# EAGLE design pomodoro (EAGLE 9.6.1)
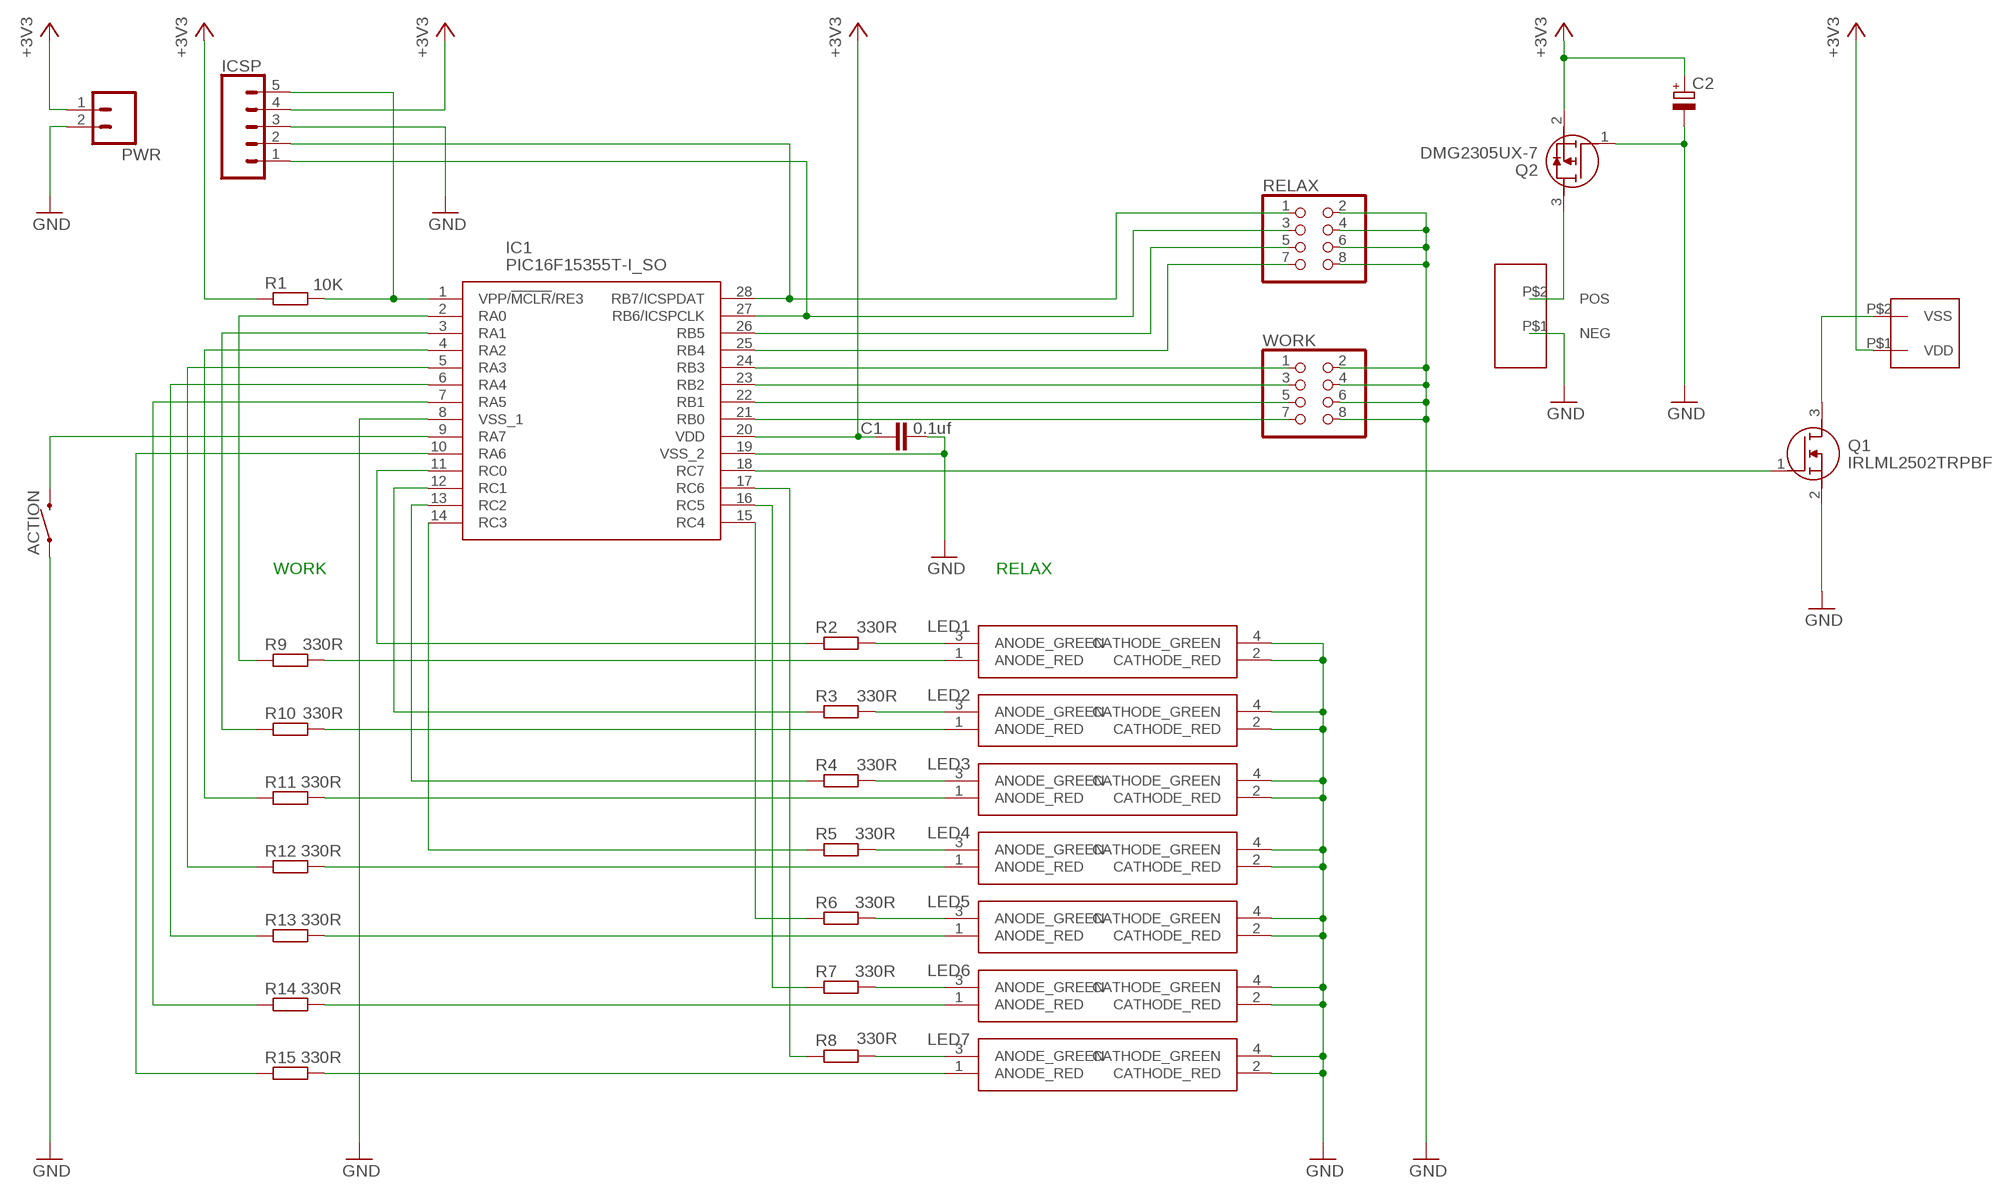
[diagram p0: schematic, sheet 1]

## Parts
ACTION  MOMENTARY-SWITCH-SPST-SMD-6.0X3.5MM  [TACTILE_SWITCH_SMD_6.0X3.5MM]
C1  0.1uf  C-EUC0805  [C0805]
C2  CPOL-EUE2.5-5  [E2,5-5]
IC1  PIC16F15355T-I_SO  [SOIC127P1030X265-28M]
ICSP  CONN_05  [1X05]
LED1  APBD3224LSURKCGKC  [APBD3224LSURKCGKC]
LED2  APBD3224LSURKCGKC  [APBD3224LSURKCGKC]
LED3  APBD3224LSURKCGKC  [APBD3224LSURKCGKC]
LED4  APBD3224LSURKCGKC  [APBD3224LSURKCGKC]
LED5  APBD3224LSURKCGKC  [APBD3224LSURKCGKC]
LED6  APBD3224LSURKCGKC  [APBD3224LSURKCGKC]
LED7  APBD3224LSURKCGKC  [APBD3224LSURKCGKC]
PWR  CONN_02  [1X02]
Q1  IRLML2502TRPBF  [SOT95P237X112-3N]
Q2  DMG2305UX-7  [SOT96P240X115-3N]
R1  10K  R-EU_R0805  [R0805]
R2  330R  R-EU_R0805  [R0805]
R3  330R  R-EU_R0805  [R0805]
R4  330R  R-EU_R0805  [R0805]
R5  330R  R-EU_R0805  [R0805]
R6  330R  R-EU_R0805  [R0805]
R7  330R  R-EU_R0805  [R0805]
R8  330R  R-EU_R0805  [R0805]
R9  330R  R-EU_R0805  [R0805]
R10  330R  R-EU_R0805  [R0805]
R11  330R  R-EU_R0805  [R0805]
R12  330R  R-EU_R0805  [R0805]
R13  330R  R-EU_R0805  [R0805]
R14  330R  R-EU_R0805  [R0805]
R15  330R  R-EU_R0805  [R0805]
RELAX  PINHD-2X4  [2X04]
U$1  2AAABATT  [2AAABATTSER]
U$2  BUZZER8X8  [BUZZER8X8]
WORK  PINHD-2X4  [2X04]

## Nets
+3V3: C1.1 C2.+ IC1.20(VDD) ICSP.4 PWR.1 Q2.2(S) R1.1 U$2.P$1(VDD)
GND: ACTION.1 C1.2 C2.- IC1.8(VSS_1) IC1.19(VSS_2) ICSP.3 LED1.2(CATHODE_RED) LED1.4(CATHODE_GREEN) LED2.2(CATHODE_RED) LED2.4(CATHODE_GREEN) LED3.2(CATHODE_RED) LED3.4(CATHODE_GREEN) LED4.2(CATHODE_RED) LED4.4(CATHODE_GREEN) LED5.2(CATHODE_RED) LED5.4(CATHODE_GREEN) LED6.2(CATHODE_RED) LED6.4(CATHODE_GREEN) LED7.2(CATHODE_RED) LED7.4(CATHODE_GREEN) PWR.2 Q1.2(S) Q2.1(G) RELAX.2 RELAX.4 RELAX.6 RELAX.8 U$1.P$1(NEG) WORK.2 WORK.4 WORK.6 WORK.8
N$1: IC1.1(VPP/!MCLR!/RE3) ICSP.5 R1.2
N$2: LED1.1(ANODE_RED) R9.2
N$3: LED2.1(ANODE_RED) R10.2
N$4: IC1.28(RB7/ICSPDAT) ICSP.2 RELAX.1
N$5: IC1.27(RB6/ICSPCLK) ICSP.1 RELAX.3
N$6: LED3.1(ANODE_RED) R11.2
N$7: LED4.1(ANODE_RED) R12.2
N$8: LED5.1(ANODE_RED) R13.2
N$9: LED6.1(ANODE_RED) R14.2
N$10: LED7.1(ANODE_RED) R15.2
N$11: LED1.3(ANODE_GREEN) R2.2
N$12: LED2.3(ANODE_GREEN) R3.2
N$13: LED3.3(ANODE_GREEN) R4.2
N$14: LED4.3(ANODE_GREEN) R5.2
N$15: LED5.3(ANODE_GREEN) R6.2
N$16: LED6.3(ANODE_GREEN) R7.2
N$17: LED7.3(ANODE_GREEN) R8.2
N$18: ACTION.2 IC1.9(RA7)
N$19: IC1.11(RC0) R2.1
N$20: IC1.12(RC1) R3.1
N$21: IC1.13(RC2) R4.1
N$22: IC1.14(RC3) R5.1
N$23: IC1.15(RC4) R6.1
N$24: IC1.16(RC5) R7.1
N$25: IC1.17(RC6) R8.1
N$26: IC1.18(RC7) Q1.1(G)
N$27: IC1.21(RB0) WORK.7
N$28: IC1.22(RB1) WORK.5
N$29: IC1.23(RB2) WORK.3
N$30: IC1.24(RB3) WORK.1
N$31: IC1.25(RB4) RELAX.7
N$32: IC1.26(RB5) RELAX.5
N$33: IC1.2(RA0) R9.1
N$34: IC1.3(RA1) R10.1
N$35: IC1.4(RA2) R11.1
N$36: IC1.5(RA3) R12.1
N$37: IC1.6(RA4) R13.1
N$38: IC1.7(RA5) R14.1
N$39: IC1.10(RA6) R15.1
N$40: Q1.3(D) U$2.P$2(VSS)
N$41: Q2.3(D) U$1.P$2(POS)

## Notes on the sheet
- WORK | RELAX

## Library data of the parts
ACTION = SparkFun-Switches:MOMENTARY-SWITCH-SPST: Momentary Switch (Pushbutton) - SPST Normally-open (NO) SPST momentary switches (buttons, pushbuttons). Variants PTH-12MM - 12mm square, through-hole Momentary Pushbutton Switch - 12mm Square <https://www.sparkfun.com/products/9190> (COM-09190) PTH-6.0MM, PTH-6.0MM-KIT - 6.0mm square, through-hole Mini Pushbutton Switch <https://www.sparkfun.com/products/97> (COM-00097) KIT package intended for soldering kit's - only one side of pads' copper is exposed. PTH-RIGHT-ANGLE-KIT - Right-angle, through-hole Right Angle Tactile Button <https://www.sparkfun.com/products/10791> - Used on SparkFun BigTime Watch Kit <https://www.sparkfun.com/products/11734> SMD-12MM - 12mm square, surface-mount Tactile Button - SMD (12mm) <https://www.sparkfun.com/products/12993> (COM-12993) Used on SparkFun PicoBoard <https://www.sparkfun.com/products/11888> SMD-4.5MM - 4.5mm Square Trackball Switch Used on SparkFun Blackberry Trackballer Breakout <https://www.sparkfun.com/products/13169> SMD-4.6MMX2.8MM - 4.60mm x 2.80mm, surface mount Used on SparkFun SAMD21 Mini Breakout <https://www.sparkfun.com/products/13664> SMD-5.2MM, SMD-5.2-REDUNDANT - 5.2mm square, surface-mount Mini Pushbutton Switch - SMD <https://www.sparkfun.com/products/8720> (COM-08720) Used on Arduino Pro Mini <https://www.sparkfun.com/products/11114> REDUNDANT package connects both switch circuits together SMD-6.0X3.5MM - 6.0 x 3.5mm, surface mount Momentary Reset Switch SMD <https://www.sparkfun.com/products/8229> (COM-08229) SMD-6.2MM-TALL - 6.2mm square, surface mount Tactile Button - SMD (6mm) <https://www.sparkfun.com/products/12992> Used on SparkFun Digital Sandbox <https://www.sparkfun.com/products/12651> SMD-RIGHT-ANGLE - Right-angle, surface mount Used on SparkFun Block for Intel® Edison - Arduino <https://www.sparkfun.com/products/13036>; PROD_ID: SWCH-14278; SF_SKU: COM-08229
C1 = rcl:C-EU: CAPACITOR, European symbol; SPICEPREFIX: C
C2 = rcl:CPOL-EU: POLARIZED CAPACITOR, European symbol; SPICEPREFIX: C
IC1 = PIC16F15355T-I_SO:PIC16F15355T-I_SO: MCU 8-bit PIC RISC 14KB Flash 3.3V/5V 28-Pin SOIC W T/R Source: Datasheet <https://componentsearchengine.com/Datasheets/1/PIC16F15355T-I_SO.pdf>; DESCRIPTION: MCU 8-bit PIC RISC 14KB Flash 3.3V/5V 28-Pin SOIC W T/R; HEIGHT: 2.65mm; MANUFACTURER_NAME: Microchip; MANUFACTURER_PART_NUMBER: PIC16F15355T-I/SO; MOUSER_PART_NUMBER: 579-PIC16F15355TI/SO; MOUSER_PRICE-STOCK: https://www.mouser.co.uk/ProductDetail/Microchip-Technology/PIC16F15355T-I-SO?qs=8cKuZ6Ok2lZJ%2F9aGIYkbmQ%3D%3D
ICSP = SparkFun-Connectors:CONN_05: Multi connection point. Often used as Generic Header-pin footprint for 0.1 inch spaced/style header connections On any of the 0.1 inch spaced packages, you can populate with these: Break Away Headers - Straight <https://www.sparkfun.com/products/116> (PRT-00116) Break Away Male Headers - Right Angle <https://www.sparkfun.com/products/553> (PRT-00553) Female Headers <https://www.sparkfun.com/products/115> (PRT-00115) Break Away Headers - Machine Pin <https://www.sparkfun.com/products/117> (PRT-00117) Break Away Female Headers - Swiss Machine Pin <https://www.sparkfun.com/products/743> (PRT-00743) For SCREWTERMINALS and SPRING TERMINALS visit here: Screw Terimnals on SparkFun.com <https://www.sparkfun.com/search/results?term=Screw+Terminals> (5mm/3.5mm/2.54mm spacing) This device is also useful as a general connection point to wire up your design to another part of your project. Our various solder wires solder well into these plated through hole pads. Hook-Up Wire - Assortment (Stranded, 22 AWG) <https://www.sparkfun.com/products/11375> (PRT-11375) Hook-Up Wire - Assortment (Solid Core, 22 AWG) <https://www.sparkfun.com/products/11367> (PRT-11367) View the entire wire category on our website here <https://www.sparkfun.com/categories/141> Special notes: Molex polarized connector foot print use with SKU : PRT-08231 with associated crimp pins and housings. 1MM SMD Version SKU: PRT-10208
LED1-LED7 = APBD3224LSURKCGKC:APBD3224LSURKCGKC: Standard LEDs - SMD 3.2x2.4MM LOW CU RED/GREEN SMD Source: Datasheet <https://www.kingbrightusa.com/images/catalog/SPEC/APBD3224LSURKCGKC.pdf>; DESCRIPTION: Standard LEDs - SMD 3.2x2.4MM LOW CU RED/GREEN SMD; HEIGHT: 2.4mm; MANUFACTURER_NAME: Kingbright; MANUFACTURER_PART_NUMBER: APBD3224LSURKCGKC; MOUSER_PART_NUMBER: 604-APBD3224LSURKCGK; MOUSER_PRICE-STOCK: https://www.mouser.co.uk/ProductDetail/Kingbright/APBD3224LSURKCGKC?qs=ZqXcJfGlKsjckDFm0SXANw%3D%3D
PWR = SparkFun-Connectors:CONN_02: Multi connection point. Often used as Generic Header-pin footprint for 0.1 inch spaced/style header connections On any of the 0.1 inch spaced packages, you can populate with these: Break Away Headers - Straight <https://www.sparkfun.com/products/116> (PRT-00116) Break Away Male Headers - Right Angle <https://www.sparkfun.com/products/553> (PRT-00553) Female Headers <https://www.sparkfun.com/products/115> (PRT-00115) Break Away Headers - Machine Pin <https://www.sparkfun.com/products/117> (PRT-00117) Break Away Female Headers - Swiss Machine Pin <https://www.sparkfun.com/products/743> (PRT-00743) For SCREWTERMINALS and SPRING TERMINALS visit here: Screw Terimnals on SparkFun.com <https://www.sparkfun.com/search/results?term=Screw+Terminals> (5mm/3.5mm/2.54mm spacing) This device is also useful as a general connection point to wire up your design to another part of your project. Our various solder wires solder well into these plated through hole pads. Hook-Up Wire - Assortment (Stranded, 22 AWG) <https://www.sparkfun.com/products/11375> (PRT-11375) Hook-Up Wire - Assortment (Solid Core, 22 AWG) <https://www.sparkfun.com/products/11367> (PRT-11367) View the entire wire category on our website here <https://www.sparkfun.com/categories/141> Special notes: Molex polarized connector foot print use with: PRT-08233 with associated crimp pins and housings. 2.54_SCREWTERM for use with PRT-10571. 3.5mm Screw Terminal footprints for PRT-08084 5mm Screw Terminal footprints for use with PRT-08432
Q1 = IRLML2502TRPBF:IRLML2502TRPBF: IRLML2502TRPBF N-Channel MOSFET, 4.2 A, 20 V IRLML2502, 3-Pin SOT-23 Infineon Source: Datasheet; DESCRIPTION: IRLML2502TRPBF N-Channel MOSFET, 4.2 A, 20 V IRLML2502, 3-Pin SOT-23 Infineon; HEIGHT: 1.12mm; MANUFACTURER_NAME: Infineon; MANUFACTURER_PART_NUMBER: IRLML2502TRPBF; MOUSER_PART_NUMBER: 942-IRLML2502TRPBF; MOUSER_PRICE-STOCK: https://www.mouser.co.uk/ProductDetail/Infineon-Technologies/IRLML2502TRPBF?qs=9%252BKlkBgLFf37zQw9UlZd%2FQ%3D%3D
Q2 = DMG2305UX-7:DMG2305UX-7: MOSFET P-Ch 20V 5A Enhancement SOT23 Diodes Inc DMG2305UX-7 P-channel MOSFET Transistor, -3.3 A, -20 V, 3-Pin SOT-23 Source: Datasheet <https://www.diodes.com//assets/Datasheets/DMG2305UX.pdf>; DESCRIPTION: MOSFET P-Ch 20V 5A Enhancement SOT23 Diodes Inc DMG2305UX-7 P-channel MOSFET Transistor, -3.3 A, -20 V, 3-Pin SOT-23; HEIGHT: 1.15mm; MANUFACTURER_NAME: Diodes Incorporated; MANUFACTURER_PART_NUMBER: DMG2305UX-7; MOUSER_PART_NUMBER: 621-DMG2305UX-7; MOUSER_PRICE-STOCK: https://www.mouser.co.uk/ProductDetail/Diodes-Incorporated/DMG2305UX-7?qs=L1DZKBg7t5F%2FNBHrjfxC%252Bg%3D%3D
R1-R15 = rcl:R-EU_: RESISTOR, European symbol; SPICEPREFIX: R
RELAX WORK = pinhead:PINHD-2X4: PIN HEADER
U$1 = 2aaabatt:2AAABATT
U$2 = buzzer:BUZZER8X8

## Board
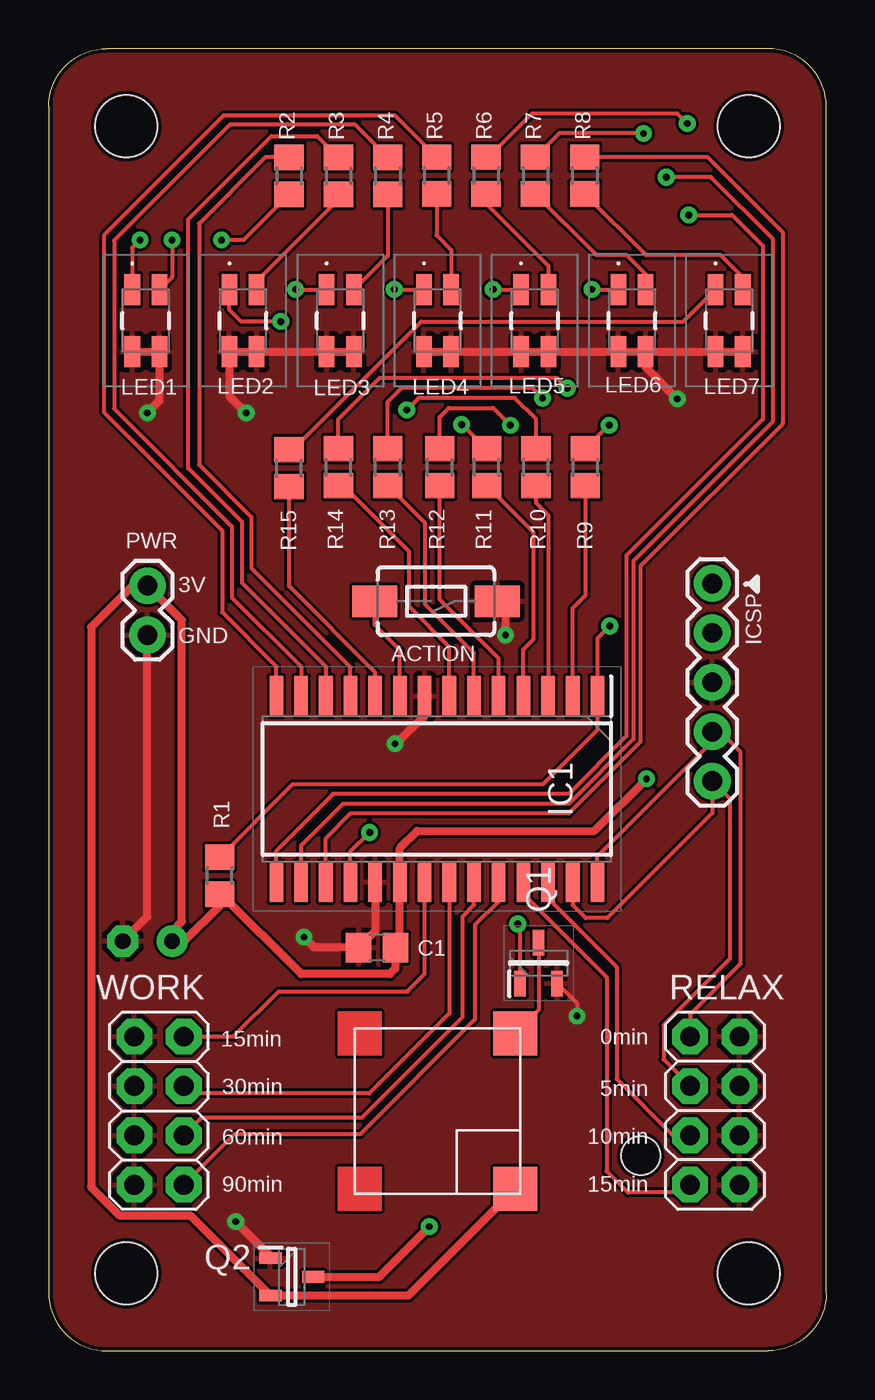
[diagram p1: board, top side]
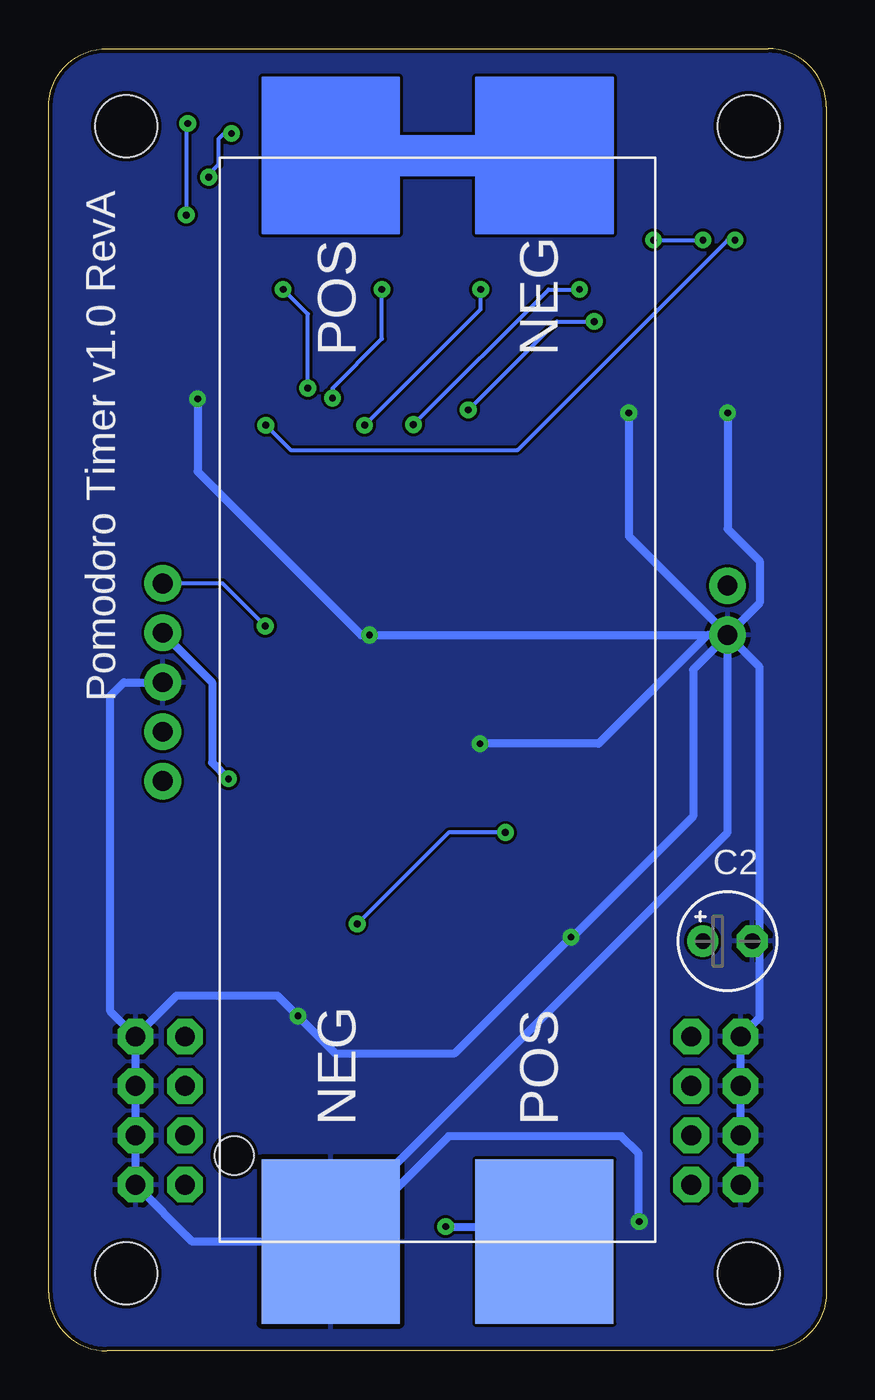
[diagram p2: board, bottom side, seen from below]

Size 40 x 67 mm. Coordinates in mm from the lower left corner, seen from the top.
Outline: 3,0 37,0 arc90 40,3 40,64 arc90 37,67 3,67 arc90 0,64 0,3 arc90 3,0
Copper layers (1*16): Top 0.035mm / dielectric 1.6mm / Bottom 0.035mm
Design rules "angelo-jlcpcb-2layers": minimum track width 8mil, minimum drill 0.3mm, track to track 6mil, track to pad 6mil, pad to pad 6mil, via to via 10mil, smd to smd 6mil, copper to edge 0.2mm, drill to drill 8mil, minimum pad ring 10mil, minimum via ring 10mil, stop-mask expansion 4mil, vias tented up to drill 0mil, thermal gap 10mil
Holes 3.2 mm at 36,63 4,63 4,4 36,4

### Footprints (pad centres in the part's own frame; a part is rotated, then mirrored left to right if it is on the bottom)
TACTILE_SWITCH_SMD_6.0X3.5MM = smd 2.3 x 1.6: 1 -3.15,0; 2 3.15,0
C0805 = smd 1.3 x 1.5: 1 -0.95,0; 2 0.95,0
E2,5-5 = drill 0.813 pad 1.6: + -1.27,0 | drill 0.813 pad 1.6 octagon: - 1.27,0
SOIC127P1030X265-28M = smd 2.05 x 0.7: 1 -4.775,8.255; 2 -4.775,6.985; 3 -4.775,5.715; 4 -4.775,4.445; 5 -4.775,3.175; 6 -4.775,1.905; 7 -4.775,0.635; 8 -4.775,-0.635; 9 -4.775,-1.905; 10 -4.775,-3.175; 11 -4.775,-4.445; 12 -4.775,-5.715; 13 -4.775,-6.985; 14 -4.775,-8.255; 15 4.775,-8.255; 16 4.775,-6.985; 17 4.775,-5.715; 18 4.775,-4.445; 19 4.775,-3.175; 20 4.775,-1.905; 21 4.775,-0.635; 22 4.775,0.635; 23 4.775,1.905; 24 4.775,3.175; 25 4.775,4.445; 26 4.775,5.715; 27 4.775,6.985; 28 4.775,8.255
1X05 = drill 1.016 pad 1.88: 1 0,0; 2 2.54,0; 3 5.08,0; 4 7.62,0; 5 10.16,0
APBD3224LSURKCGKC = smd 1.6 x 0.8: 1 1.6,0.7; 2 -1.6,0.7; 3 1.6,-0.7; 4 -1.6,-0.7
1X02 = drill 1.016 pad 1.88: 1 0,0; 2 2.54,0
SOT95P237X112-3N = smd 1.3 x 0.6: 1 -1.05,0.95; 2 -1.05,-0.95; 3 1.05,0
SOT96P240X115-3N = smd 1.15 x 0.6: 1 -1.1,0.96; 2 -1.1,-0.96; 3 1.1,0
R0805 = smd 1.3 x 1.5: 1 -0.95,0; 2 0.95,0
2X04 = drill 1.016 octagon: 1 -3.81,-1.27; 2 -3.81,1.27; 3 -1.27,-1.27; 4 -1.27,1.27; 5 1.27,-1.27; 6 1.27,1.27; 7 3.81,-1.27; 8 3.81,1.27
2AAABATTSER = smd 8.45 x 7.1: P$1 -27.875,5.5; P$2 -27.875,-5.5 | hole 2: -23.45,10.45
BUZZER8X8 = smd 2.25 x 2.25: P$1 4,-4; P$2 4,4

### Placement (x,y rotation side)
ACTION  19.92,38.57 180 top
C1  16.89,20.75 180 top
C2  5.08,21.08 0 bottom
IC1  19.97,28.91 270 top
ICSP  34.13,29.32 90 top
LED1  5,53 90 top
LED2  10,53 90 top
LED3  15,53 90 top
LED4  20,53 90 top
LED5  25,53 90 top
LED6  30,53 90 top
LED7  35,53 90 top
PWR  5.08,39.37 270 top
Q1  25.2,19.95 90 top
Q2  12.51,3.81 0 top
R1  8.79,24.45 90 top
R2  12.37,60.45 270 top
R3  14.91,60.45 270 top
R4  17.45,60.45 270 top
R5  19.95,60.47 270 top
R6  22.49,60.47 270 top
R7  25.03,60.47 270 top
R8  27.57,60.47 270 top
R9  27.61,45.47 90 top
R10  25.07,45.47 90 top
R11  22.53,45.47 90 top
R12  20.11,45.47 90 top
R13  17.45,45.47 90 top
R14  14.91,45.47 90 top
R15  12.37,45.42 90 top
RELAX  34.26,12.36 270 top
U$1  20,33.5 90 bottom
U$2  20,12.34 0 top
WORK  5.68,12.36 90 top

### Tracks (layer width: path | path; a pad name or v marks a point on that pad's centre or on a via)
+3V3  (via drill 0.35)
  Top 0.406: v30.75,29.43 28.07,26.75 18.95,26.75 18.07,25.87 IC1.20 18.07,20.97 C1.1 17.84,19.67 17.56,19.38 12.98,19.38 8.87,23.5 R1.1 8.79,22.89 6.99,21.08 C2.+ 6.35,21.59 6.86,22.1 6.86,37.59 PWR.1 4.32,39.37 2.19,37.24 2.19,8.42 3.66,6.95 7.31,6.95 Q2.2 18.51,2.85 U$2.P$1
  Bottom 0.406: ICSP.4 31.59,34.4 31.59,30.27 v30.75,29.43
GND  (via drill 0.35)
  Top 0.203: Q1.2 27.18,17.87 v27.18,17.23
  Top 0.406: v13.14,21.28 13.67,20.75 C1.2 16.8,21.6 IC1.19 | IC1.8 19.34,32.68 17.89,31.24 v17.81,31.24 | ACTION.1 23.5,38.14 v23.5,36.83 | C2.- 5.08,22.35 PWR.2 | LED7.4 LED7.2 LED6.4 | LED6.4 LED6.2 LED5.4 LED5.2 LED4.4 LED4.2 | LED3.4 LED3.2 LED2.4 LED2.2 9.3,49.12 v10.16,48.26 | LED6.4 30.7,50.61 v32.34,48.98 | LED1.2 LED1.4 5.7,48.88 v5.08,48.26 | Q2.1 11.41,4.86 v9.62,6.65
  Bottom 0.406: v17.81,31.24 11.71,31.24 6.12,36.83 PWR.2 | WORK.2 WORK.4 WORK.6 WORK.8 3.43,17.15 3.43,35.18 PWR.2 | RELAX.2 RELAX.4 RELAX.6 RELAX.8 32.6,5.62 U$1.P$1 | ICSP.3 36.13,34.4 36.83,33.7 36.83,17.47 RELAX.2 | PWR.2 6.86,35.05 6.86,27.5 13.07,21.28 v13.14,21.28 19.11,15.31 25.26,15.31 v27.18,17.23 28.24,18.29 33.41,18.29 RELAX.2 | v32.34,48.98 32.34,45.24 23.92,36.83 v23.5,36.83 PWR.2 | U$1.P$1 25.5,6.26 5.08,26.68 PWR.2 | v10.16,48.26 10.16,41.91 PWR.2 | v5.08,48.26 5.08,42.29 3.43,40.64 3.43,38.48 PWR.2 | v9.62,6.65 9.65,6.68 9.65,10.16 10.54,11.05 19.43,11.05 24.86,5.62 U$1.P$1
  pour Top: 0,0 0,66.94 39.94,66.94 39.94,0
  pour Bottom: 0,0 39.94,0 39.94,66.94 0,66.94
N$1  (via drill 0.35)
  Top 0.203: v28.86,37.29 28.23,36.66 IC1.1 28.23,31.96 25.43,29.16 12.56,29.16 R1.2
  Bottom 0.203: v28.86,37.29 31.05,39.48 ICSP.5
N$2  (via drill 0.35)
  Top 0.203: v28.83,47.62 28.82,47.62 R9.2 | LED1.1 4.3,56.75 v4.7,57.15
  Bottom 0.203: v28.83,47.62 27.56,46.35 15.88,46.35 5.08,57.15 v4.7,57.15
N$3  (via drill 0.35)
  Top 0.203: R10.2 25.07,47.94 23.98,49.02 19.03,49.02 v18.41,48.41 | v11.94,52.96 9.91,52.96 9.3,53.56 LED2.1
  Bottom 0.203: v18.41,48.41 13.87,52.96 v11.94,52.96
N$4
  Top 0.203: RELAX.1 32.99,17.31 35.58,19.9 35.58,30.83 34.55,31.86 ICSP.2 34,31.73 34,31.23 28.23,25.45 IC1.28
N$5
  Top 0.203: IC1.27 26.95,22.93 27.62,22.27 28.73,22.27 34.13,27.67 ICSP.1 35.02,28.43 35.02,20.16 31.62,16.76 31.62,15 RELAX.3
N$6  (via drill 0.35)
  Top 0.203: R11.2 21.34,47.61 21.34,47.62 21.31,47.66 v21.24,47.66 | v12.7,54.61 LED3.1
  Bottom 0.203: v21.24,47.66 14.29,54.61 v12.7,54.61
N$7  (via drill 0.35)
  Top 0.203: R12.2 20.11,48.05 20.57,48.51 22.86,48.51 v23.75,47.62 | v17.78,54.61 LED4.1
  Bottom 0.203: v23.75,47.62 17.78,53.59 v17.78,54.61
N$8  (via drill 0.35)
  Top 0.203: R13.2 17.45,48.83 18.15,49.53 24.89,49.53 v25.4,49.02 | v22.86,54.61 LED5.1
  Bottom 0.203: v25.4,49.02 25.4,49.53 22.86,52.07 v22.86,54.61
N$9  (via drill 0.35)
  Top 0.203: R14.2 14.91,47.94 17,50.04 26.16,50.04 v26.67,49.53 | v27.94,54.61 LED6.1
  Bottom 0.203: v26.67,49.53 26.67,53.34 v27.94,54.61
N$10
  Top 0.203: R15.2 12.62,46.42 19.16,52.96 32.64,52.96 34.28,54.6 LED7.1
N$11  (via drill 0.35)
  Top 0.203: R2.2 10.01,57.15 v8.89,57.15 | v6.35,57.15 6.35,55.25 LED1.3
  Bottom 0.203: v8.89,57.15 v6.35,57.15
N$12
  Top 0.203: R3.2 14.91,59.23 10.7,55.02 LED2.3
N$13
  Top 0.203: R4.2 17.45,56.35 LED3.3
N$14
  Top 0.203: R5.2 19.95,57.39 20.7,56.64 LED4.3
N$15
  Top 0.203: R6.2 22.49,59.04 25.7,55.83 LED5.3
N$16
  Top 0.203: R7.2 28.16,56.39 29.72,56.39 30.7,55.41 LED6.3
N$17
  Top 0.203: R8.2 30.7,56.39 34.54,56.39 35.7,55.23 LED7.3
N$18
  Top 0.203: IC1.9 18.07,36.05 16.77,37.35 ACTION.2
N$19
  Top 0.203: R2.1 11.14,61.4 7.75,58.01 7.75,45.59 10.43,42.91 10.43,40.28 15.53,35.18 IC1.11
N$20
  Top 0.203: IC1.12 14.26,35.21 9.94,39.53 9.94,42.66 7.18,45.41 7.18,58.22 11.46,62.5 13.81,62.5 R3.1
N$21
  Top 0.203: IC1.13 12.98,35.21 9.43,38.76 9.43,42.42 3.37,48.48 3.37,57.13 9.33,63.09 15.76,63.09 R4.1
N$22
  Top 0.203: R5.1 17.8,63.57 9.01,63.57 2.84,57.4 2.84,48.29 8.92,42.2 8.92,38 11.71,35.21 IC1.14
N$23  (via drill 0.35)
  Top 0.203: IC1.15 11.71,25.73 14.64,28.66 26.75,28.66 29.72,31.62 29.72,40.93 36.73,47.94 36.73,56.85 35.15,58.44 v32.92,58.44 | R6.1 22.62,61.42 24.86,63.66 32.33,63.66 v32.84,63.15
  Bottom 0.203: v32.84,63.15 32.92,63.06 v32.92,58.44
N$24  (via drill 0.35)
  Top 0.203: IC1.16 12.98,26 15.14,28.15 26.75,28.15 30.07,31.48 30.07,40.65 37.24,47.81 37.24,57.21 34.06,60.39 v31.77,60.39 | R7.1 26.25,62.64 v30.59,62.64
  Bottom 0.203: v31.77,60.39 31.77,60.53 31.27,61.02 31.27,62.34 30.97,62.64 v30.59,62.64
N$25
  Top 0.203: IC1.17 14.26,26.38 15.52,27.64 26.74,27.64 30.43,31.33 30.43,40.37 37.75,47.68 37.75,57.57 33.89,61.42 R8.1
N$26  (via drill 0.35)
  Top 0.203: IC1.18 15.53,25.68 v16.51,26.67 | Q1.1 24.25,21.85 v24.13,21.97
  Bottom 0.203: v16.51,26.67 19.43,26.67 v24.13,21.97
N$27
  Top 0.203: IC1.21 19.34,19.38 18.45,18.5 11.83,18.5 9.5,16.17 WORK.7
N$28
  Top 0.203: WORK.5 7.33,13.25 16.49,13.25 20.61,17.36 IC1.22
N$29
  Top 0.203: IC1.23 21.88,22.93 21.27,22.33 21.27,17.17 16.09,11.99 7.85,11.99 WORK.3
N$30
  Top 0.203: WORK.1 9.55,11.15 16.02,11.15 21.92,17.05 21.92,21.91 23.14,23.13 IC1.24
N$31
  Top 0.203: IC1.25 24.41,23.5 28.7,19.21 28.7,9.23 29.79,8.15 32.59,8.15 RELAX.7
N$32
  Top 0.203: IC1.26 25.68,23.27 29.21,19.75 29.21,13.99 32.11,11.09 RELAX.5
N$33
  Top 0.203: R9.1 27.61,38.86 26.95,38.21 IC1.2
N$34
  Top 0.203: R10.1 25.07,43.63 25.7,42.99 25.7,33.7 IC1.3
N$35
  Top 0.203: IC1.4 24.41,36.1 24.92,36.6 24.92,42.12 R11.1
N$36
  Top 0.203: IC1.5 23.14,35.63 20.11,38.67 R12.1
N$37
  Top 0.203: IC1.6 21.88,35.89 19.35,38.42 19.35,42.61 R13.1
N$38
  Top 0.203: IC1.7 20.61,36.22 18.54,38.29 18.54,41.14 15.16,44.52 R14.1
N$39
  Top 0.203: IC1.10 16.8,34.91 12.37,39.34 R15.1
N$40
  Top 0.203: U$2.P$2 25.2,17.54 Q1.3
N$41  (via drill 0.35)
  Top 0.406: v19.58,6.4 16.99,3.81 Q2.3
  Bottom 0.406: U$1.P$2 15.27,6.4 v19.58,6.4

### Text on the board
tNames: 3V | GND | 0min | 15min | 30min | 5min | 60min | 10min | 90min | 15min
bNames: Pomodoro Timer v1.0 RevA